# Altium schematic sheet Display.SchDoc
size A
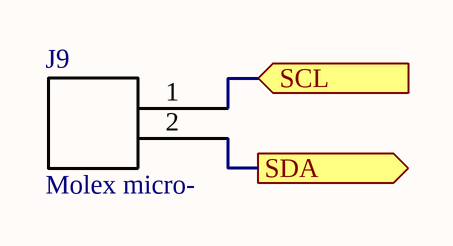
[diagram p0: Display.SchDoc]

## Parts
J9  Molex micro-  [0430450227]

## Ports
SCL (in), SDA (out)

## Nets
SCL: J9.1 ; port SCL
SDA: J9.2 ; port SDA

## Library data of the parts
J9 = Molex micro-fit 2-pin: Molex micro-fit 3.0. Molex P/N 0430450227